# EAGLE design night_light (EAGLE 5.11)
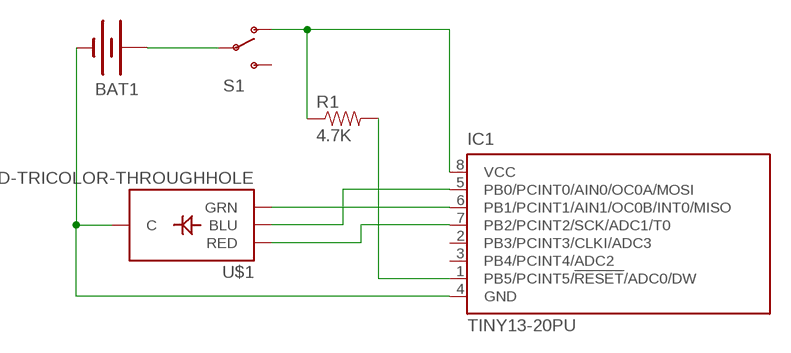
[diagram p0: schematic, sheet 1]

## Parts
BAT1  BATTERY20PTH  [BATTCOM_20MM_PTH]
IC1  TINY13-20PU  [DIL08]
R1  4.7K  RESISTORPTH1  [AXIAL-0.3]
S1  SWITCH-SPSTPTH  [SWITCH-SPDT]
U$1  LED-TRICOLOR-THROUGHHOLE  [LED-TRICOLOR-THROUGHHOLE]

## Nets
N$1: IC1.1(PB5/PCINT5/!RESET!/ADC0/DW) R1.P$2
N$2: IC1.8(VCC) R1.P$1 S1.1(O)
N$3: BAT1.1(+) S1.2(P)
N$4: BAT1.2(-) IC1.4(GND) U$1.GND(C)
N$6: IC1.5(PB0/PCINT0/AIN0/OC0A/MOSI) U$1.BLU
N$7: IC1.6(PB1/PCINT1/AIN1/OC0B/INT0/MISO) U$1.GRN
N$8: IC1.7(PB2/PCINT2/SCK/ADC1/T0) U$1.RED
Unconnected: IC1.2(PB3/PCINT3/CLKI/ADC3) IC1.3(PB4/PCINT4/ADC2) S1.3(S)

## Library data of the parts
BAT1 = SparkFun:BATTERY: Battery Holders Various common sizes : AA, AAA, 20mm coin cell and 12mm coin cell.
IC1 = atmel:TINY13: 8-bit AVR Microcontroller with 1K Bytes In-System Programmable Flash Source: http://www.atmel.com/dyn/resources/prod_documents/2535S.pdf; MPN: ATTINY13-20PU; OC_FARNELL: 9171550; OC_NEWARK: 96K6521
R1 = SparkFun:RESISTOR: Resistor Basic schematic elements and footprints for 0603, 1206, and PTH 1/10th watt (small) resistors.
S1 = SparkFun:SWITCH-SPST: SPST Switch Simple slide switch. Spark Fun Electronics SKU : COM-00102
U$1 = SparkFun:LED-TRICOLOR-THROUGHHOLE

## Board
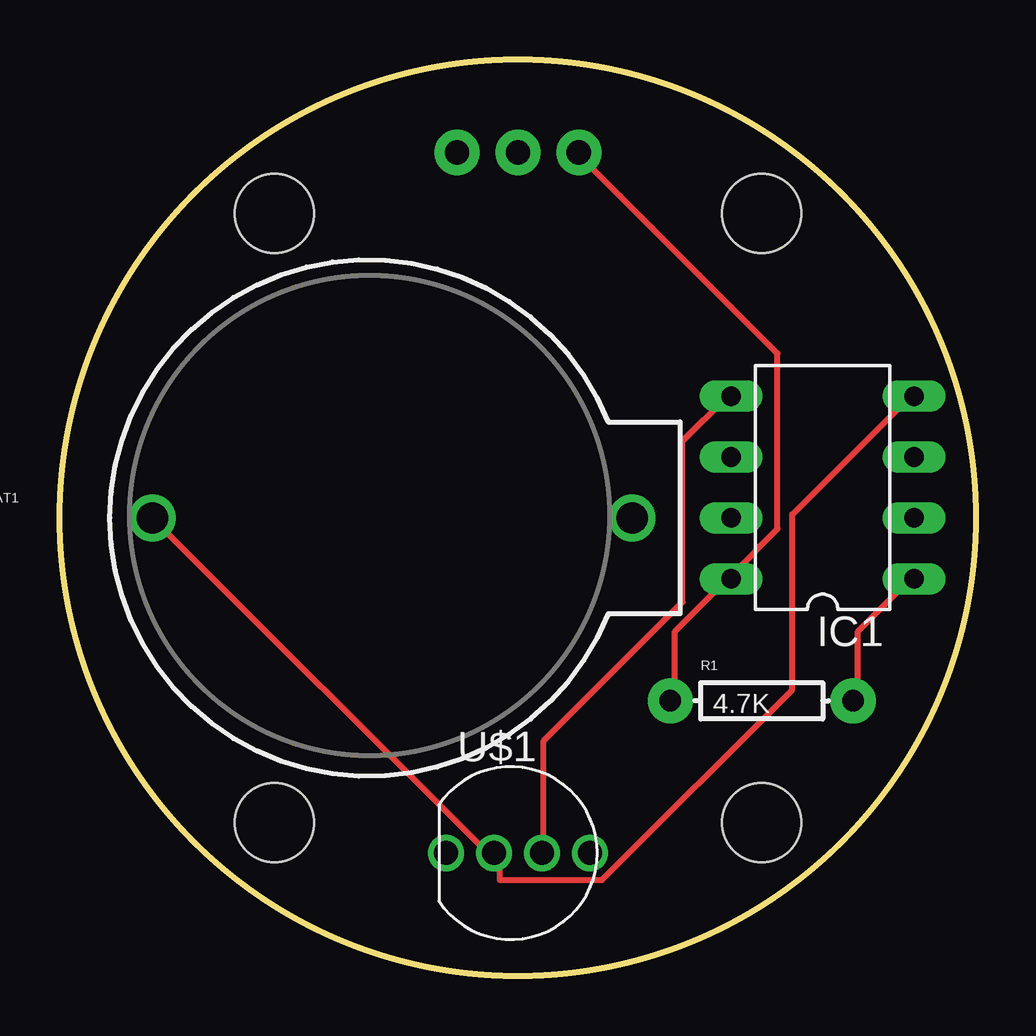
[diagram p1: board, top side]
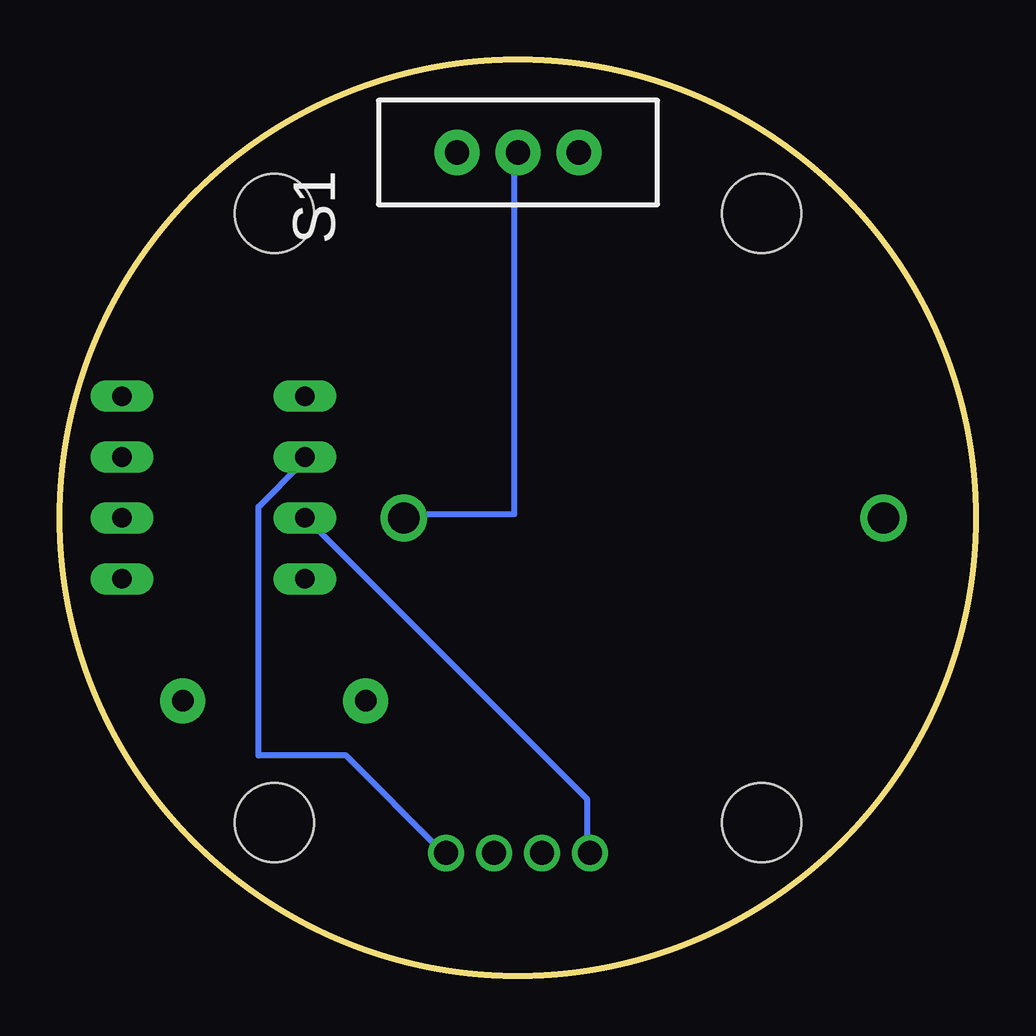
[diagram p2: board, bottom side, seen from below]

Size 38.18 x 38.18 mm. Coordinates in mm from the lower left corner, seen from the top.
Outline: circle at 19.09,19.09 radius 19.09
Copper layers (1*16): Top 0.035mm / dielectric 1.5mm / Bottom 0.035mm
Design rules "default": minimum track width 10mil, minimum drill 24mil, track to track 8mil, track to pad 8mil, pad to pad 8mil, via to via 8mil, smd to smd 8mil, copper to edge 40mil, drill to drill 8mil, minimum pad ring 10mil, minimum via ring 8mil, stop-mask expansion 4mil, vias tented up to drill 0mil, thermal gap 10mil

### Footprints (pad centres in the part's own frame; a part is rotated, then mirrored left to right if it is on the bottom)
BATTCOM_20MM_PTH = drill 1.3 round: 1 20,0; 2 0,0
DIL08 = drill 0.813 long: 1 -3.81,-3.81; 2 -1.27,-3.81; 3 1.27,-3.81; 4 3.81,-3.81; 5 3.81,3.81; 6 1.27,3.81; 7 -1.27,3.81; 8 -3.81,3.81
AXIAL-0.3 = drill 0.9 pad 1.88 round: P$1 -3.81,0; P$2 3.81,0
SWITCH-SPDT = drill 1.016 pad 1.88 round: 1 0,2.54; 2 0,0; 3 0,-2.54
LED-TRICOLOR-THROUGHHOLE = drill 1 round: BLU 1,0; GND -1,0; GRN 3,0; RED -3,0
STAND-OFF = hole 3.302: 0,0

### Placement (x,y rotation side)
BAT1  3.85,19.09 0 top
IC1  31.79,20.36 90 top
R1  29.25,11.47 0 top
S1  19.09,34.33 90 bottom
U$1  19.09,5.12 0 top
U$2  [STAND-OFF]  29.25,31.79 0 top
U$3  [STAND-OFF]  29.25,6.39 0 top
U$4  [STAND-OFF]  8.93,31.79 0 top
U$5  [STAND-OFF]  8.93,6.39 0 top

### Tracks (layer width: path | path; a pad name or v marks a point on that pad's centre or on a via)
N$1
  Top 0.254: IC1.1 35.4,16.5 33.27,14.37 33.27,11.62 R1.P$2
N$2
  Top 0.254: R1.P$1 25.65,11.62 25.65,14.37 27.78,16.5 IC1.8 28.08,16.81 29.91,18.64 29.91,25.95 21.68,34.18 S1.1
N$3
  Bottom 0.254: S1.2 19.24,34.18 19.24,19.24 23.82,19.24 BAT1.1
N$4
  Top 0.254: IC1.4 35.4,24.12 30.52,19.24 30.52,11.93 22.6,4 18.33,4 18.33,4.92 U$1.GND 18.03,4.92 BAT1.2
N$6
  Top 0.254: IC1.5 27.78,24.12 25.95,22.29 25.95,15.59 20.16,9.8 20.16,5.22 U$1.BLU
N$7
  Bottom 0.254: IC1.6 28.08,21.38 29.91,19.55 29.91,9.19 26.26,9.19 22.29,5.22 U$1.GRN
N$8
  Bottom 0.254: IC1.7 27.78,18.94 16.2,7.36 16.2,5.22 U$1.RED